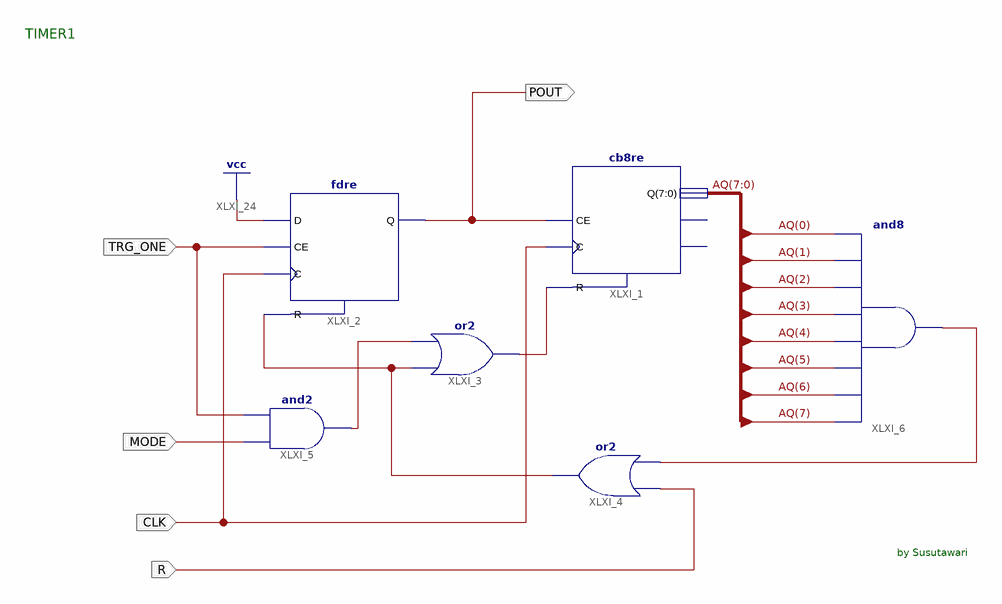
[diagram p0: schematic sheet 1]
// Xilinx ISE schematic TIMER1.sch (spartan3e) as structural Verilog: 6 symbols, 5 ports
module TIMER1 (
  input  CLK,
  input  MODE,
  input  TRG_ONE,
  input  R,
  output POUT
);

  wire XLXN_1, XLXN_6, XLXN_9, XLXN_37;
  wire [7:0] AQ;

  fdre XLXI_2 (.C(CLK), .CE(TRG_ONE), .D(1'b1), .R(XLXN_6), .Q(POUT));
  or XLXI_3 (XLXN_1, XLXN_6, XLXN_9);
  cb8re XLXI_1 (.C(CLK), .CE(POUT), .R(XLXN_1), .Q(AQ));  // open: CEO, TC
  or XLXI_4 (XLXN_6, R, XLXN_37);
  and XLXI_5 (XLXN_9, MODE, TRG_ONE);
  and XLXI_6 (XLXN_37, AQ[7], AQ[6], AQ[5], AQ[4], AQ[3], AQ[2], AQ[1], AQ[0]);

  // Notes on the sheet:
  //   TIMER1
  //   by Susutawari
endmodule
